# EAGLE design FLASH_memory (EAGLE 7.5.0)
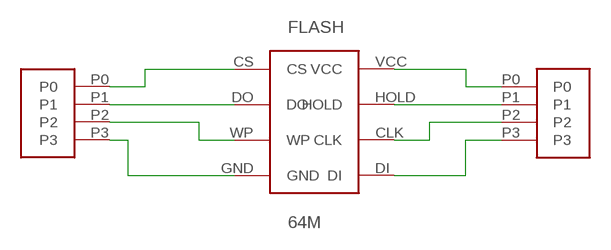
[diagram p0: schematic, sheet 1]

## Parts
FLASH  64M  FLASH_W25Q64FVSSIG  [FLASH_W25Q64FVSSIG]
U$2  4PIN  [4PIN]
U$3  4PIN  [4PIN]

## Nets
GND: FLASH.GND U$2.P3
N$1: FLASH.CS U$2.P0
N$2: FLASH.VCC U$3.P0
N$3: FLASH.DO U$2.P1
N$4: FLASH.HOLD U$3.P1
N$5: FLASH.WP U$2.P2
N$6: FLASH.CLK U$3.P2
N$8: FLASH.DI U$3.P3

## Library data of the parts
FLASH = My_STM32:FLASH_W25Q64FVSSIG
U$2 U$3 = My_STM32:4PIN

## Board
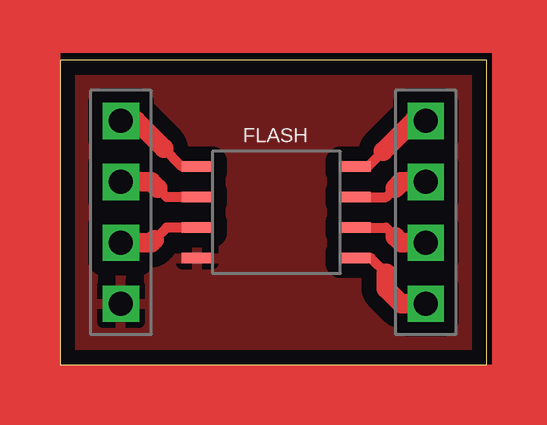
[diagram p1: board, top side]

Size 17.78 x 12.7 mm. Coordinates in mm from the lower left corner, seen from the top.
Outline: 0,0 17.78,0 17.78,12.7 0,12.69 0,0
Copper layers (1*16): Top 0.035mm / dielectric 1.5mm / Bottom 0.035mm
Design rules "default *": minimum track width 10mil, minimum drill 24mil, track to track 8mil, track to pad 8mil, pad to pad 8mil, via to via 8mil, smd to smd 8mil, copper to edge 20mil, drill to drill 8mil, minimum pad ring 10mil, minimum via ring 8mil, stop-mask expansion 4mil, vias tented up to drill 0mil, thermal gap 10mil

### Footprints (pad centres in the part's own frame; a part is rotated, then mirrored left to right if it is on the bottom)
FLASH_W25Q64FVSSIG = smd 1.27 x 0.432: CLK 2.794,-1.27; CS -3.81,1.27; DI 2.794,-2.54; DO -3.81,0; GND -3.81,-2.54; HOLD 2.794,0; VCC 2.794,1.27; WP -3.81,-1.27
4PIN = drill 1 square: P0 0,2.54; P1 0,0; P2 0,-2.54; P3 0,-5.08

### Placement (x,y rotation side)
FLASH  9.53,6.99 0 top
U$2  2.54,7.62 0 top
U$3  15.24,7.62 0 top

### Tracks (layer width: path | path; a pad name or v marks a point on that pad's centre or on a via)
GND
  pour Top (isolate 0.61): 0,12.7 0,0 17.78,0 17.78,12.7
N$1
  Top 0.406: FLASH.CS 5.08,8.26 4.32,9.02
  Top 0.813: 4.32,9.02 3.17,10.16 U$2.P0
N$2
  Top 0.406: FLASH.VCC 12.83,8.26 13.46,8.89
  Top 0.813: 13.46,8.89 14.73,10.16 U$3.P0
N$3
  Top 0.406: FLASH.DO 4.45,6.99 4.06,7.37
  Top 0.813: 4.06,7.37 3.81,7.62 U$2.P1
N$4
  Top 0.406: FLASH.HOLD 13.59,6.99 13.97,7.37
  Top 0.813: 13.97,7.37 14.22,7.62 U$3.P1
N$5
  Top 0.406: FLASH.WP 4.45,5.71 3.94,5.21
  Top 0.813: 3.94,5.21 3.81,5.08 U$2.P2
N$6
  Top 0.406: FLASH.CLK 13.59,5.71 13.97,5.33
  Top 0.813: 13.97,5.33 14.22,5.08 U$3.P2
N$8
  Top 0.406: FLASH.DI 12.95,4.45 13.59,3.81
  Top 0.813: 13.59,3.81 13.59,3.17 14.22,2.54 U$3.P3
(copper drawn outside any net)
  shapes: Top area x4